# EAGLE design ParallelCNC (EAGLE 6.2)
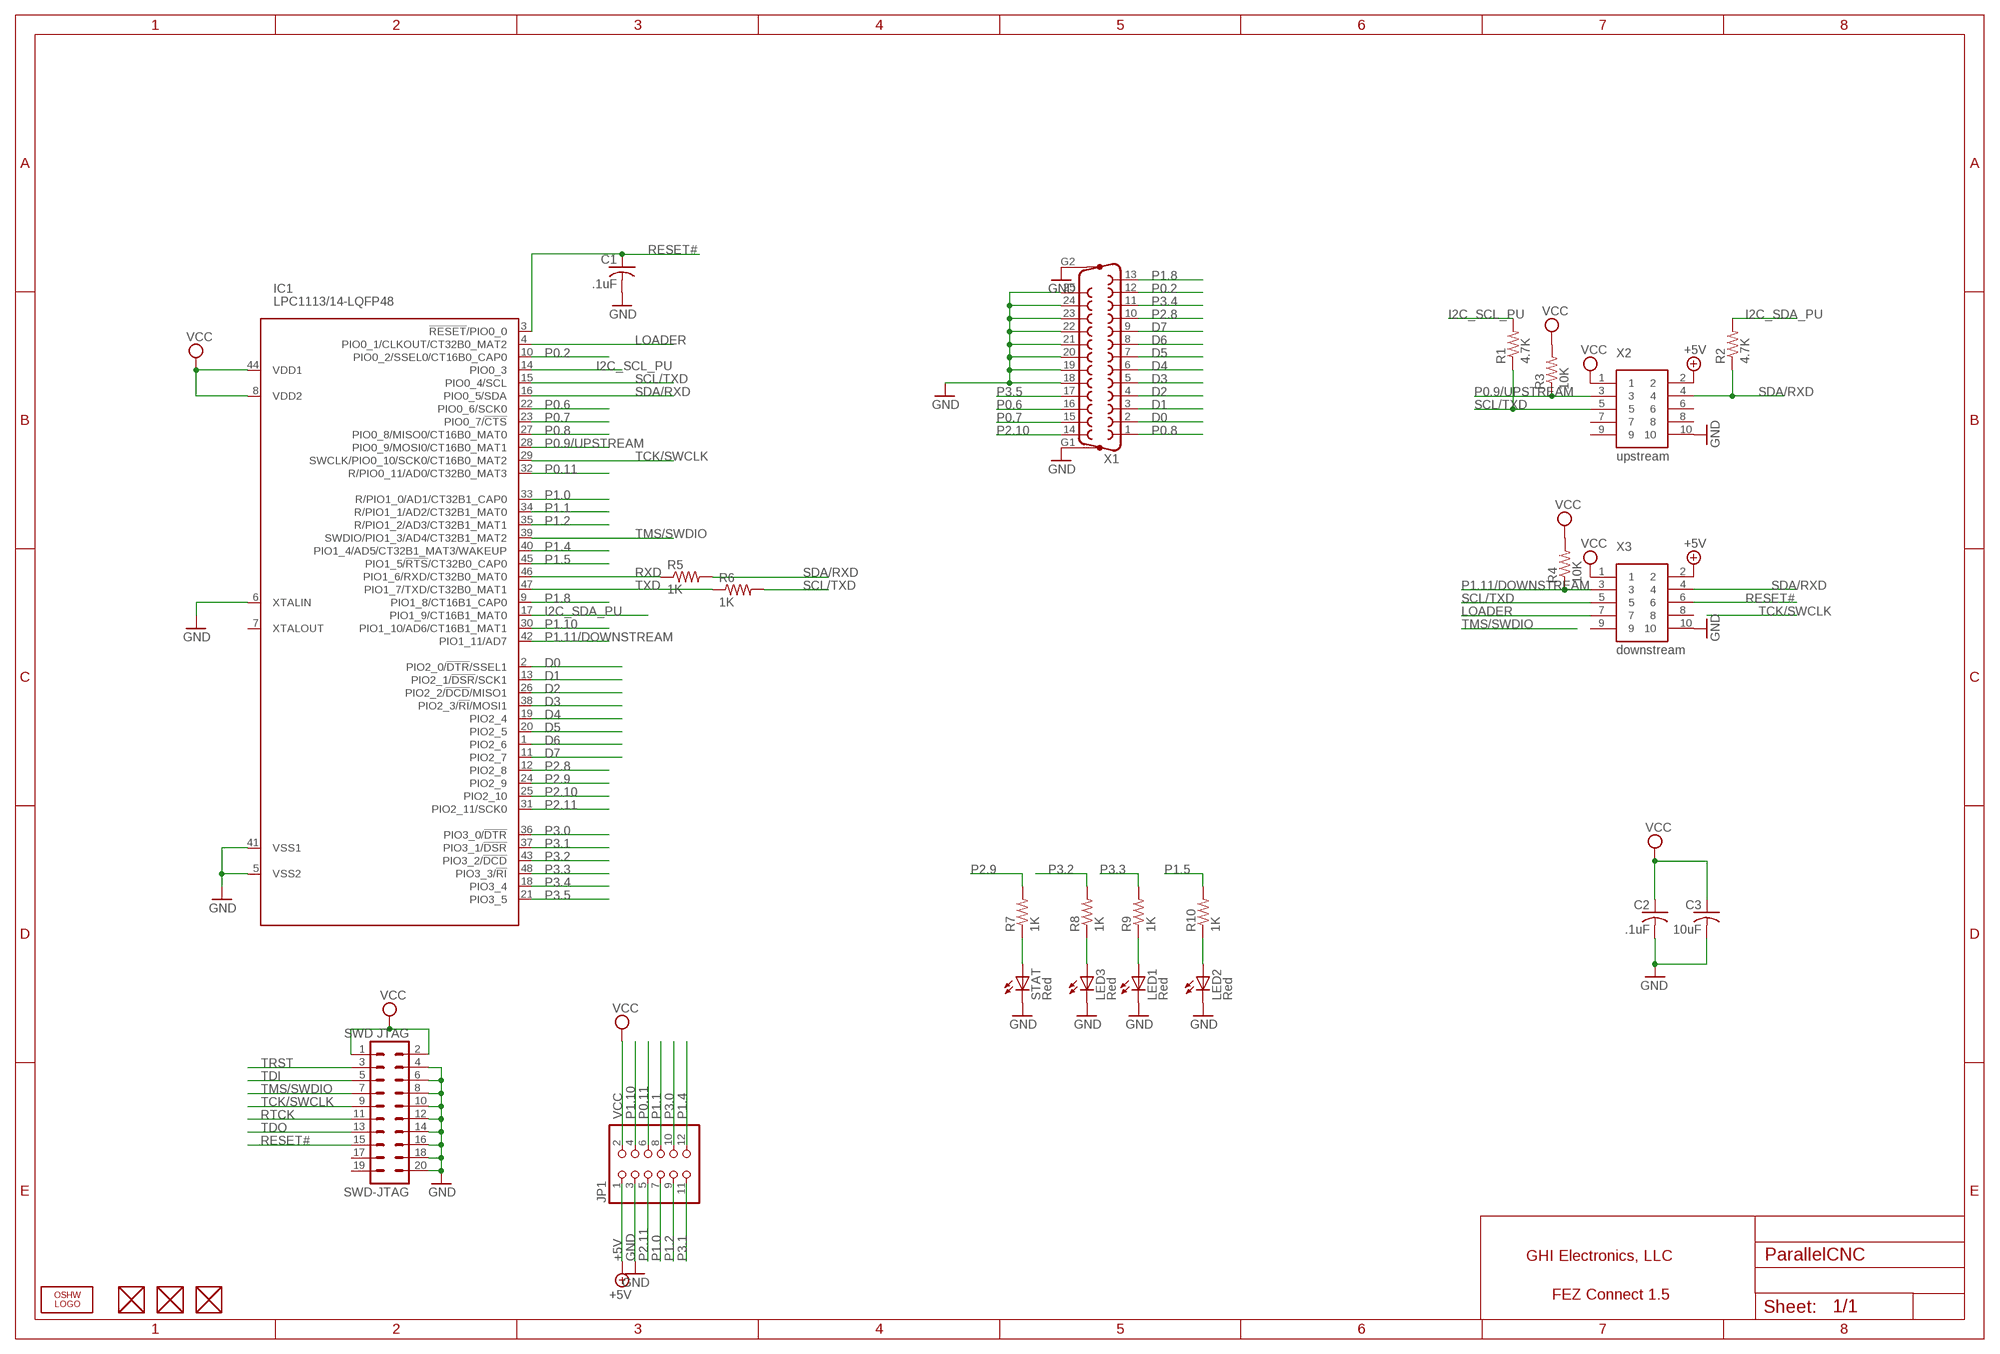
[diagram p0: schematic, sheet 1]

## Parts
C1  .1uF  C-USC0603K  [C0603K]
C2  .1uF  C-USC0603K  [C0603K]
C3  10uF  C-USC0805K  [C0805K]
FUD1  FIDUCIAL  [FIDUCIAL_40MIL]
FUD2  FIDUCIAL  [FIDUCIAL_40MIL]
FUD3  FIDUCIAL  [FIDUCIAL_40MIL]
IC1  LPC1113/14-LQFP48  [LQFP48]
JP1  PINHD-2X6  [2X06]
LED1  Red  LEDCHIPLED_0805  [CHIPLED_0805]
LED2  Red  LEDCHIPLED_0805  [CHIPLED_0805]
LED3  Red  LEDCHIPLED_0805  [CHIPLED_0805]
LOGO1  LOGO-OSHW-FILLX0200-NT  [OSHW_FILLX200_NOTEXT]
R1  4.7K  R-US_R0603  [R0603]
R2  4.7K  R-US_R0603  [R0603]
R3  10K  R-US_R0603  [R0603]
R4  10K  R-US_R0603  [R0603]
R5  1K  R-US_R0603  [R0603]
R6  1K  R-US_R0603  [R0603]
R7  1K  R-US_R0603  [R0603]
R8  1K  R-US_R0603  [R0603]
R9  1K  R-US_R0603  [R0603]
R10  1K  R-US_R0603  [R0603]
STAT  Red  LEDCHIPLED_0805  [CHIPLED_0805]
SWD-JTAG  SWD JTAG  MA10-2  [MA10-2]
X1  F25HP  [F25HP]
X2  upstream  2X5_1.27MM  [2X5_1.27MM]
X3  downstream  2X5_1.27MM  [2X5_1.27MM]

## Nets
+5V: JP1.1 X2.2 X3.2
D0: IC1.2(PIO2_0/!DTR!/SSEL1) X1.2
D1: IC1.13(PIO2_1/!DSR!/SCK1) X1.3
D2: IC1.26(PIO2_2/!DCD!/MISO1) X1.4
D3: IC1.38(PIO2_3/!RI!/MOSI1) X1.5
D4: IC1.19(PIO2_4) X1.6
D5: IC1.20(PIO2_5) X1.7
D6: IC1.1(PIO2_6) X1.8
D7: IC1.11(PIO2_7) X1.9
GND [power]: C1.2 C2.2 C3.2 IC1.5(VSS2) IC1.6(XTALIN) IC1.41(VSS1) JP1.3 LED1.C LED2.C LED3.C STAT.C SWD-JTAG.4 SWD-JTAG.6 SWD-JTAG.8 SWD-JTAG.10 SWD-JTAG.12 SWD-JTAG.14 SWD-JTAG.16 SWD-JTAG.18 SWD-JTAG.20 X1.18 X1.19 X1.20 X1.21 X1.22 X1.23 X1.24 X1.25 X1.G1 X1.G2 X2.10 X3.10
I2C_SCL_PU: IC1.14(PIO0_3) R1.2
I2C_SDA_PU: IC1.17(PIO1_9/CT16B1_MAT0) R2.2
LOADER: IC1.4(PIO0_1/CLKOUT/CT32B0_MAT2) X3.7
N$3: LED3.A R8.1
N$4: LED1.A R9.1
N$5: LED2.A R10.1
N$10: R7.1 STAT.A
P0.2: IC1.10(PIO0_2/SSEL0/CT16B0_CAP0) X1.12
P0.6: IC1.22(PIO0_6/SCK0) X1.16
P0.7: IC1.23(PIO0_7/!CTS!) X1.15
P0.8: IC1.27(PIO0_8/MISO0/CT16B0_MAT0) X1.1
P0.9/UPSTREAM: IC1.28(PIO0_9/MOSI0/CT16B0_MAT1) R3.1 X2.3
P0.11: IC1.32(R/PIO0_11/AD0/CT32B0_MAT3) JP1.6
P1.0: IC1.33(R/PIO1_0/AD1/CT32B1_CAP0) JP1.7
P1.1: IC1.34(R/PIO1_1/AD2/CT32B1_MAT0) JP1.8
P1.2: IC1.35(R/PIO1_2/AD3/CT32B1_MAT1) JP1.9
P1.4: IC1.40(PIO1_4/AD5/CT32B1_MAT3/WAKEUP) JP1.12
P1.5: IC1.45(PIO1_5/!RTS!/CT32B0_CAP0) R10.2
P1.8: IC1.9(PIO1_8/CT16B1_CAP0) X1.13
P1.10: IC1.30(PIO1_10/AD6/CT16B1_MAT1) JP1.4
P1.11/DOWNSTREAM: IC1.42(PIO1_11/AD7) R4.1 X3.3
P2.8: IC1.12(PIO2_8) X1.10
P2.9: IC1.24(PIO2_9) R7.2
P2.10: IC1.25(PIO2_10) X1.14
P2.11: IC1.31(PIO2_11/SCK0) JP1.5
P3.0: IC1.36(PIO3_0/!DTR!) JP1.10
P3.1: IC1.37(PIO3_1/!DSR!) JP1.11
P3.2: IC1.43(PIO3_2/!DCD!) R8.2
P3.3: IC1.48(PIO3_3/!RI!) R9.2
P3.4: IC1.18(PIO3_4) X1.11
P3.5: IC1.21(PIO3_5) X1.17
RESET#: C1.1 IC1.3(!RESET!/PIO0_0) SWD-JTAG.15 X3.6
RTCK: SWD-JTAG.11
RXD: IC1.46(PIO1_6/RXD/CT32B0_MAT0) R5.1
SCL/TXD: IC1.15(PIO0_4/SCL) R1.1 R6.2 X2.5 X3.5
SDA/RXD: IC1.16(PIO0_5/SDA) R2.1 R5.2 X2.4 X3.4
TCK/SWCLK: IC1.29(SWCLK/PIO0_10/SCK0/CT16B0_MAT2) SWD-JTAG.9
TDI: SWD-JTAG.5
TDO: SWD-JTAG.13
TMS/SWDIO: IC1.39(SWDIO/PIO1_3/AD4/CT32B1_MAT2) SWD-JTAG.7
TRST: SWD-JTAG.3
TXD: IC1.47(PIO1_7/TXD/CT32B0_MAT1) R6.1
VCC [power]: C2.1 C3.1 IC1.8(VDD2) IC1.44(VDD1) JP1.2 R3.2 R4.2 SWD-JTAG.1 SWD-JTAG.2 X2.1 X3.1
Unconnected: FUD1.P$1 FUD2.P$1 FUD3.P$1 IC1.7(XTALOUT) SWD-JTAG.17 SWD-JTAG.19 X2.6 X2.7 X2.8 X2.9 X3.8 X3.9

## Notes on the sheet
- Optional 3.3V
- GHI Electronics, LLC
- FEZ Connect 1.5

## Library data of the parts
C1-C3 = rcl:C-US: CAPACITOR, American symbol
FUD1-FUD3 = GHI:FIDUCIAL
IC1 = lpc1100v1.1:LPC1113/14-LQFP48: NXP Semiconductors LPC11xx microcontrollers <http://ics.nxp.com/products/lpc1000/lpc11xx/> ARM 32-bit Cortex-M0 Microcontroller with MPU CPU clock up to 50MHz Up to 32KByte on-chip Flash ROM with In-System Programming (ISP) and In-Application Programming (IAP) via On-Chip Bootloader Up to 8KByte SRAM Nested Vectored Interrupt Controller Up to 2 SPI controllers UART with full Modem Interface and RS485 Support Fast Mode I2C-Bus 4 Timers with 4 capture channels and 13 output channels Watchdog (WDT) Sytem tick timer 10-bit ADC with 8 channels Power Management Unit (PMU) Brownout detection 12MHz internal RC oscillator Serial Wire Debug/Trace port
JP1 = pinhead:PINHD-2X6: PIN HEADER
LED1-LED3 STAT = led:LED: LED OSRAM: - CHIPLED LG R971, LG N971, LY N971, LG Q971, LY Q971, LO R971, LY R971 LH N974, LH R974 LS Q976, LO Q976, LY Q976 LO Q996 - Hyper CHIPLED LW Q18S LB Q993, LB Q99A, LB R99A - SideLED LS A670, LO A670, LY A670, LG A670, LP A670 LB A673, LV A673, LT A673, LW A673 LH A674 LY A675 LS A676, LA A676, LO A676, LY A676, LW A676 LS A679, LY A679, LG A679 - Hyper Micro SIDELED® LS Y876, LA Y876, LO Y876, LY Y876 LT Y87S - SmartLED LW L88C, LW L88S LB L89C, LB L89S, LG L890 LS L89K, LO L89K, LY L89K LS L896, LA L896, LO L896, LY L896 - TOPLED LS T670, LO T670, LY T670, LG T670, LP T670 LSG T670, LSP T670, LSY T670, LOP T670, LYG T670 LG T671, LOG T671, LSG T671 LB T673, LV T673, LT T673, LW T673 LH T674 LS T676, LA T676, LO T676, LY T676, LB T676, LH T676, LSB T676, LW T676 LB T67C, LV T67C, LT T67C, LS T67K, LO T67K, LY T67K, LW E67C LS E67B, LA E67B, LO E67B, LY E67B, LB E67C, LV E67C, LT E67C LW T67C LS T679, LY T679, LG T679 LS T770, LO T770, LY T770, LG T770, LP T770 LB T773, LV T773, LT T773, LW T773 LH T774 LS E675, LA E675, LY E675, LS T675 LS T776, LA T776, LO T776, LY T776, LB T776 LHGB T686 LT T68C, LB T68C - Hyper Mini TOPLED® LB M676 - Mini TOPLED Santana® LG M470 LS M47K, LO M47K, LY M47K Source: http://www.osram.convergy.de LUXEON: - LUMILED® LXK2-PW12-R00, LXK2-PW12-S00, LXK2-PW14-U00, LXK2-PW14-V00 LXK2-PM12-R00, LXK2-PM12-S00, LXK2-PM14-U00 LXK2-PE12-Q00, LXK2-PE12-R00, LXK2-PE12-S00, LXK2-PE14-T00, LXK2-PE14-U00 LXK2-PB12-K00, LXK2-PB12-L00, LXK2-PB12-M00, LXK2-PB14-N00, LXK2-PB14-P00, LXK2-PB14-Q00 LXK2-PR12-L00, LXK2-PR12-M00, LXK2-PR14-Q00, LXK2-PR14-R00 LXK2-PD12-Q00, LXK2-PD12-R00, LXK2-PD12-S00 LXK2-PH12-R00, LXK2-PH12-S00 LXK2-PL12-P00, LXK2-PL12-Q00, LXK2-PL12-R00 Source: www.luxeon.com KINGBRIGHT: KA-3528ASYC Source: www.kingbright.com
LOGO1 = Logo:LOGO-OSHW-FILL
R1-R10 = rcl:R-US_: RESISTOR, American symbol
SWD-JTAG = con-lstb:MA10-2: PIN HEADER
X1 = con-subd:F25HP: SUB-D; OC_FARNELL: unknown; OC_NEWARK: unknown
X2 X3 = GHI:2X5_1.27MM

## Board
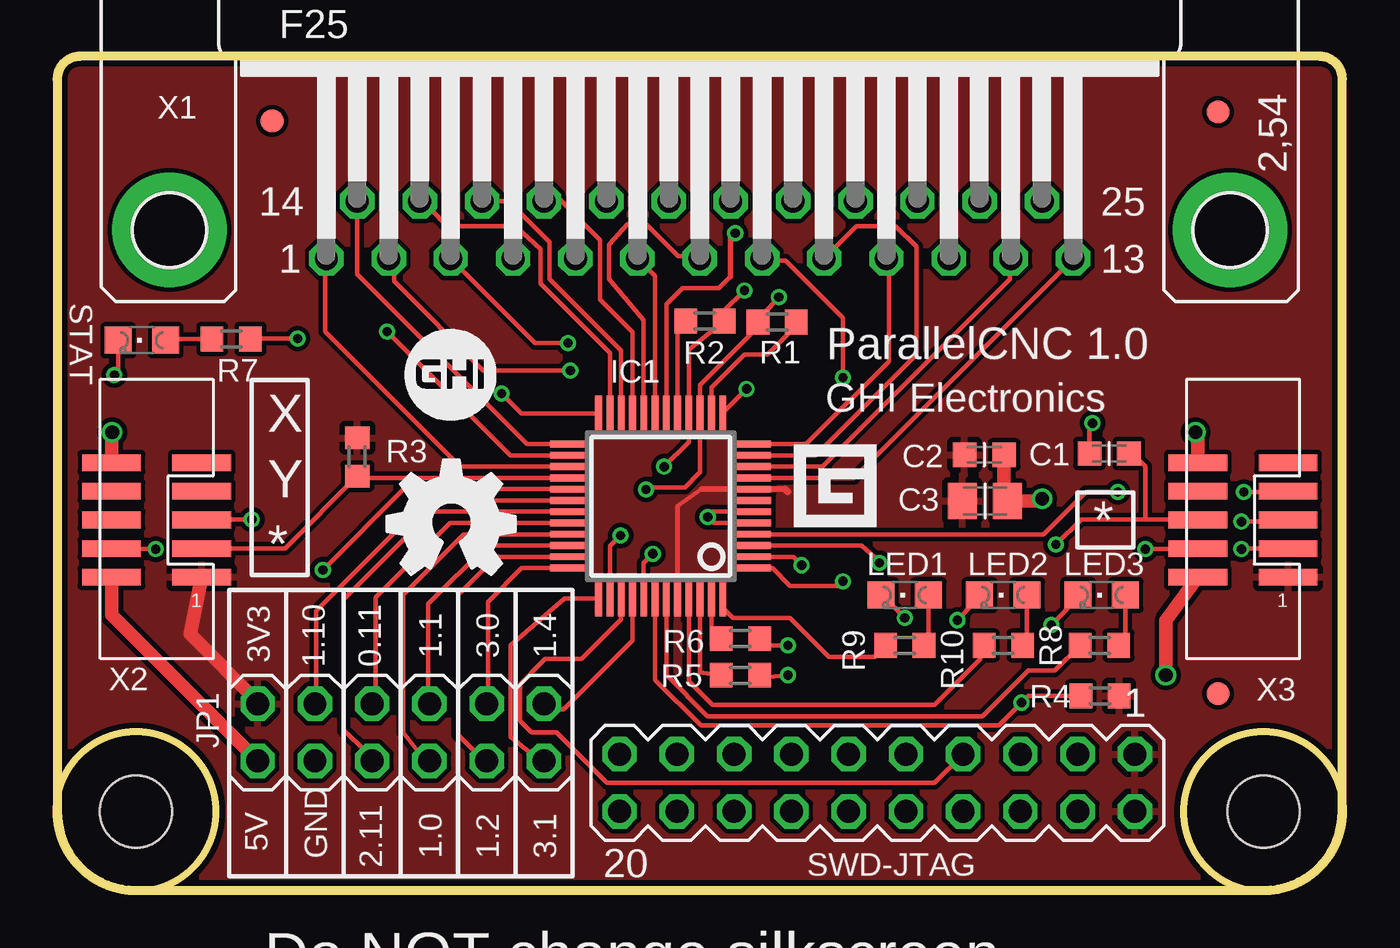
[diagram p1: board, top side]
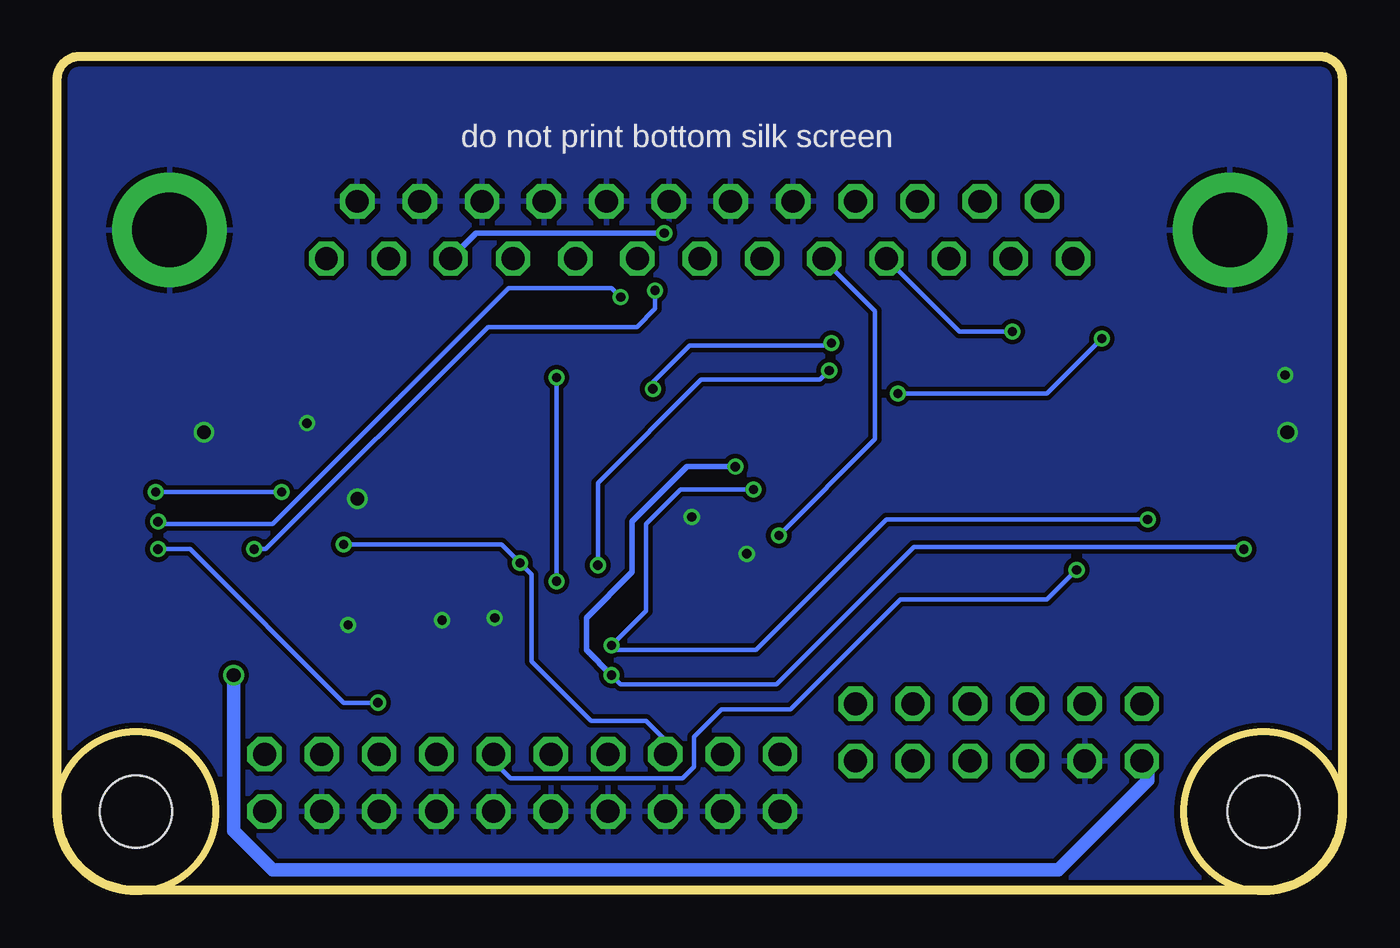
[diagram p2: board, bottom side, seen from below]

Size 57.07 x 37.04 mm. Coordinates in mm from the lower left corner, seen from the top.
Outline: 53.54,0.04 arc90 57.04,3.54 57.04,36.04 arc90 56.04,37.04 1.04,37.04 arc90 0.04,36.04 0.04,3.54 arc90 3.54,0.04 53.54,0.04
Outline: circle at 53.54,3.54 radius 3.54
Outline: circle at 3.54,3.54 radius 3.54
Copper layers (1*16): Top 0.035mm / dielectric 1.5mm / Bottom 0.035mm
Design rules: minimum track width 0.0025mm, minimum drill 10mil, track to track 8mil, track to pad 8mil, pad to pad 7.5mil, via to via 8mil, smd to smd 7.5mil, copper to edge 10mil, drill to drill 10mil, minimum pad ring 10mil, minimum via ring 6mil, stop-mask expansion 2mil, vias tented up to drill 100mil, thermal gap 10mil
Holes 3.2 mm at 3.54,3.54 53.54,3.54

### Footprints (pad centres in the part's own frame; a part is rotated, then mirrored left to right if it is on the bottom)
C0603K = smd 1.05 x 1.08: 1 -0.875,0; 2 0.875,0
C0805K = smd 1.3 x 1.6: 1 -1,0; 2 1,0
FIDUCIAL_40MIL = smd 1.016 x 1.016: P$1 0,0
LQFP48 = smd 0.3 x 1.6: 1 -2.75,-4.1; 2 -2.25,-4.1; 3 -1.75,-4.1; 4 -1.25,-4.1; 5 -0.75,-4.1; 6 -0.25,-4.1; 7 0.25,-4.1; 8 0.75,-4.1; 9 1.25,-4.1; 10 1.75,-4.1; 11 2.25,-4.1; 12 2.75,-4.1; 25 2.75,4.1; 26 2.25,4.1; 27 1.75,4.1; 28 1.25,4.1; 29 0.75,4.1; 30 0.25,4.1; 31 -0.25,4.1; 32 -0.75,4.1; 33 -1.25,4.1; 34 -1.75,4.1; 35 -2.25,4.1; 36 -2.75,4.1 | smd 1.6 x 0.3: 13 4.1,-2.75; 14 4.1,-2.25; 15 4.1,-1.75; 16 4.1,-1.25; 17 4.1,-0.75; 18 4.1,-0.25; 19 4.1,0.25; 20 4.1,0.75; 21 4.1,1.25; 22 4.1,1.75; 23 4.1,2.25; 24 4.1,2.75; 37 -4.1,2.75; 38 -4.1,2.25; 39 -4.1,1.75; 40 -4.1,1.25; 41 -4.1,0.75; 42 -4.1,0.25; 43 -4.1,-0.25; 44 -4.1,-0.75; 45 -4.1,-1.25; 46 -4.1,-1.75; 47 -4.1,-2.25; 48 -4.1,-2.75
2X06 = drill 1.016 octagon: 1 -6.35,-1.27; 2 -6.35,1.27; 3 -3.81,-1.27; 4 -3.81,1.27; 5 -1.27,-1.27; 6 -1.27,1.27; 7 1.27,-1.27; 8 1.27,1.27; 9 3.81,-1.27; 10 3.81,1.27; 11 6.35,-1.27; 12 6.35,1.27
CHIPLED_0805 = smd 1.2 x 1.2: A 0,-1.05; C 0,1.05
R0603 = smd 1 x 1.1: 1 -0.85,0; 2 0.85,0
MA10-2 = drill 1.016 octagon: 1 -11.43,-1.27; 2 -11.43,1.27; 3 -8.89,-1.27; 4 -8.89,1.27; 5 -6.35,-1.27; 6 -6.35,1.27; 7 -3.81,-1.27; 8 -3.81,1.27; 9 -1.27,-1.27; 10 -1.27,1.27; 11 1.27,-1.27; 12 1.27,1.27; 13 3.81,-1.27; 14 3.81,1.27; 15 6.35,-1.27; 16 6.35,1.27; 17 8.89,-1.27; 18 8.89,1.27; 19 11.43,-1.27; 20 11.43,1.27
F25HP = drill 1.016 octagon: 1 -16.561,-1.27; 2 -13.792,-1.27; 3 -11.049,-1.27; 4 -8.28,-1.27; 5 -5.512,-1.27; 6 -2.769,-1.27; 7 0,-1.27; 8 2.769,-1.27; 9 5.512,-1.27; 10 8.28,-1.27; 11 11.049,-1.27; 12 13.792,-1.27; 13 16.561,-1.27; 14 -15.189,1.27; 15 -12.421,1.27; 16 -9.652,1.27; 17 -6.909,1.27; 18 -4.14,1.27; 19 -1.372,1.27; 20 1.372,1.27; 21 4.14,1.27; 22 6.909,1.27; 23 9.652,1.27; 24 12.421,1.27; 25 15.189,1.27 | drill 3.302 pad 5.08: G1 -23.52,0; G2 23.52,0
2X5_1.27MM = smd 2.6 x 0.74: 1 -2,2.58; 2 2,2.58; 3 -2,1.31; 4 2,1.31; 5 -2,0.04; 6 2,0.04; 7 -2,-1.23; 8 2,-1.23; 9 -2,-2.5; 10 2,-2.5

### Placement (x,y rotation side)
C1  46.7,19.42 180 top
C2  41.16,19.36 0 top
C3  41.18,17.31 0 top
FUD1  51.53,8.77 0 top
FUD2  51.53,34.58 0 top
FUD3  9.57,34.17 0 top
IC1  26.8,17.09 90 top
JP1  15.28,7.05 0 top
LED1  37.63,13.14 90 top
LED2  42,13.14 90 top
LED3  46.37,13.14 90 top
LOGO1  14.68,14.06 0 top
R1  31.97,25.25 0 top
R2  28.76,25.29 180 top
R3  13.35,19.26 90 top
R4  46.29,8.67 0 top
R5  30.34,9.58 0 top
R6  30.34,11.21 0 top
R7  7.76,24.5 0 top
R8  46.26,10.91 180 top
R9  37.63,10.91 180 top
R10  42,10.91 180 top
STAT  3.79,24.44 90 top
SWD-JTAG  36.41,4.81 180 top
X1  28.54,29.33 0 top
X2  4.45,16.51 180 top
X3  52.63,16.51 180 top

### Tracks (layer width: path | path; a pad name or v marks a point on that pad's centre or on a via)
+5V  (via drill 0.61)
  Top 0.61: X3.2 49.21,12.01 v49.21,9.59 | X2.2 2.45,12.26 JP1.1
  Bottom 0.61: v49.21,9.59 49.21,2.68 47.48,0.95 12.63,0.95 8.67,4.91 8.67,5.52 JP1.1
D0  (via drill 0.41)
  Top 0.203: IC1.2 32.68,14.84 v33.06,14.46 | v22.79,23.1 18.93,23.1 14.97,27.06 14.97,27.84 X1.2
  Bottom 0.203: v33.06,14.46 33.06,18.12 28.48,22.69 23.2,22.69 v22.79,23.1
D1  (via drill 0.41)
  Top 0.203: IC1.13 29.55,21.22 v30.62,22.29 | v22.69,24.32 21.23,24.32 X1.3
  Bottom 0.203: v30.62,22.29 30.62,22.59 28.99,24.22 22.79,24.22 v22.69,24.32
D2  (via drill 0.41)
  Top 0.203: IC1.26 20.16,19.34 v14.67,24.83
  Bottom 0.203: v14.67,24.83 17.02,24.83 X1.4
D3  (via drill 0.41)
  Top 0.203: IC1.38 24.55,15.31 v25.03,15.78
  Bottom 0.203: X1.5 23.02,28 20.76,25.74 20.76,20.05 v25.03,15.78
D4
  Top 0.203: IC1.19 26.55,27.28 X1.6
D5
  Top 0.203: IC1.20 26.05,25.33 24.52,27.16 24.52,28.69 25.33,29.6 26.15,29.6 27.57,28.18 28.42,28.18 X1.7
D6  (via drill 0.41)
  Top 0.203: IC1.1 31.76,14.34 32.55,13.55 34.68,13.55 v34.88,13.75 | v34.88,22.79 34.88,25.44 32.34,27.98 31.39,27.98 X1.8
  Bottom 0.203: v34.88,13.75 v34.88,22.79
D7
  Top 0.203: IC1.11 33.66,19.34 38.14,23.81 38.14,28.59 37.22,29.5 35.48,29.5 X1.9
GND  (via drill 0.41, 0.61)
  Top 0.203: IC1.41 26.05,14.57 v26.45,14.97 | IC1.6 29.13,16.84 v28.89,16.6 29.15,16.34 IC1.5 | STAT.C 2.74,23.06 v2.58,22.9 | LED1.C 36.61,13.14 v37.63,12.13 | LED2.C 40.95,13.07 v39.96,12.02 | LED3.C 45.32,13.01 v44.13,11.82 | C1.2 45.82,20.62 v45.96,20.76
  Top 0.61: X3.10 50.63,20.26 v50.53,20.36 | X2.10 2.45,20.33 v2.47,20.36 | v43.72,17.41 43.62,17.31 C3.2 42.03,17.46 C2.2
  pour Bottom: -0.17,37.04 56.95,37.04 56.95,0.04 -0.17,0.04
I2C_SCL_PU
  Top 0.203: IC1.14 29.05,22.35 30.52,23.81 31.53,23.81 32.45,24.72 32.45,25.22 R1.2
I2C_SDA_PU
  Top 0.203: IC1.17 27.55,25.23 R2.2
LOADER  (via drill 0.41)
  Top 0.203: v52.66,17.71 54.6,17.71 X3.7 | IC1.4 43.78,15.84 45.65,17.71 v47.08,17.71
  Bottom 0.203: v47.08,17.71 v52.66,17.71
N$3
  Top 0.203: LED3.A 47.42,11.21 R8.1
N$4
  Top 0.203: LED1.A 38.68,11.11 R9.1
N$5
  Top 0.203: LED2.A 43.05,11.11 R10.1
N$10
  Top 0.203: R7.1 4.9,24.5 STAT.A
P0.2
  Top 0.203: IC1.10 33.97,18.84 42.3,27.16 42.3,28.04 X1.12
P0.6
  Top 0.203: IC1.22 25.05,23.99 21.88,27.16 21.88,28.79 20.05,30.62 18.73,30.62
  Top 0.254: 18.73,30.62 18.87,30.62 X1.16
P0.7
  Top 0.203: IC1.23 24.55,23.88 21.47,26.96 21.47,28.48 20.36,29.5 17.31,29.5 16.19,30.72
  Top 0.254: 16.19,30.72 16.19,30.68 X1.15
P0.8
  Top 0.203: IC1.27 17.91,18.84 11.92,24.83 11.92,27.98 12.23,28.28
  Top 0.254: 11.92,27.98 11.92,28.01 X1.1
P0.9/UPSTREAM
  Top 0.203: IC1.28 13.43,18.34 R3.1 10.14,15.2 X2.3
P0.11
  Top 0.203: IC1.32 17.45,16.34 14.16,13.04 14.16,8.57
  Top 0.254: 14.16,8.57 14.16,8.47 JP1.6
P1.0
  Top 0.203: IC1.33 18.07,15.84 15.38,13.14 15.38,7.05 16.49,5.62
  Top 0.254: 16.49,5.62 16.49,5.73 JP1.7
P1.1
  Top 0.203: IC1.34 19.1,15.34 16.49,12.74 16.49,8.37 | JP1.8 16.6,8.27
  Top 0.254: 16.49,8.37 JP1.8
P1.2
  Top 0.203: IC1.35 19.51,14.84 17.82,13.14 17.82,6.94 19.03,5.73
  Top 0.254: 19.03,5.73 JP1.9
P1.4
  Top 0.203: IC1.40 25.55,11.12 22.49,8.06 21.88,8.06
  Top 0.254: 21.88,8.06 JP1.12
P1.5
  Top 0.203: IC1.45 28.05,9.31 29.09,8.27 38.95,8.27 40.98,10.3 40.98,10.74 R10.2
P1.8
  Top 0.203: IC1.9 35.37,18.34 X1.13
P1.10
  Top 0.203: IC1.30 16.42,17.34 11.52,12.43 11.52,8.37 11.72,8.16
  Top 0.254: 11.52,8.37 JP1.4
P1.11/DOWNSTREAM  (via drill 0.41)
  Top 0.203: X3.3 52.59,15.2 v52.56,15.17 | IC1.42 26.55,9.38 28.59,7.35 41.79,7.35 v42.81,8.37 43.11,8.67 R4.1
  Bottom 0.203: v52.56,15.17 51.13,15.17 44.33,8.37 v42.81,8.37
P2.8
  Top 0.203: IC1.12 33.25,19.84 36.92,23.51 36.92,27.77 36.81,27.87
  Top 0.254: 36.81,27.87 X1.10
P2.9  (via drill 0.41)
  Top 0.203: IC1.24 20.64,21.19 v19.75,22.08 | v10.7,24.52 8.63,24.52 R7.2
  Bottom 0.203: v19.75,22.08 13.14,22.08 v10.7,24.52
P2.10
  Top 0.203: IC1.25 20.87,19.84 13.35,27.37 13.35,30.62 13.45,30.72
  Top 0.254: 13.35,30.62 X1.14
P2.11
  Top 0.203: IC1.31 16.63,16.84 12.74,12.94 12.74,7.15 14.36,5.62
  Top 0.254: 14.36,5.62 14.16,5.62 JP1.5
P3.0
  Top 0.203: IC1.36 20.64,14.34 19.14,12.84 19.14,8.37
  Top 0.254: 19.14,8.37 JP1.10
P3.1
  Top 0.203: IC1.37 22.54,12.99 20.15,10.91 20.15,6.84 21.78,5.52
  Top 0.254: 21.78,5.52 21.78,5.62 JP1.11
P3.2
  Top 0.203: IC1.43 27.05,9.59 28.89,7.76 41.08,7.76 43.11,9.79 44.3,9.79 R8.2
P3.3
  Top 0.203: IC1.48 29.55,12.58 30.01,12.13 32.55,12.13 34.27,10.4 36.31,10.4 36.31,10.44 R9.2
P3.4  (via drill 0.41)
  Top 0.203: IC1.18 27.05,26.04 27.77,26.76 29.4,26.76 29.91,27.26
  Top 0.254: 29.91,27.26 29.91,28.99 v30.11,29.19
  Bottom 0.254: v30.11,29.19 38.45,29.19 X1.11
P3.5
  Top 0.203: IC1.21 25.55,24.81 24.11,26.25 24.11,28.89 22.29,30.72 21.47,30.72 21.27,30.52
  Top 0.254: 21.47,30.72 21.51,30.72 X1.17
RESET#  (via drill 0.41)
  Top 0.203: IC1.3 35.7,15.34 36.51,14.63 v36.51,14.56 | X3.6 50.6,16.49 48.3,16.49 | 48.3,16.49 45.45,16.49 v44.33,15.38 | C1.1 47.71,19.42 48.3,18.83 48.3,16.49
  Bottom 0.203: SWD-JTAG.15 30.06,6.69 30.92,7.55 33.36,7.55 36,10.2 36,14.06 v36.51,14.56 37.32,15.38 v44.33,15.38
RXD
  Top 0.203: IC1.46 28.55,9.7 R5.1
SCL/TXD  (via drill 0.41)
  Top 0.203: v32.04,26.35 31.12,25.33 R1.1 31.02,24.95 30.62,24.52 28.55,22.46 IC1.15 28.55,18.6 27.87,17.92 26.25,17.92 v26.15,17.82 | v52.56,16.39 54.55,16.39 X3.5 | v8.67,16.49 6.47,16.49 X2.5 | v32.45,10.91 31.39,10.91 R6.2
  Bottom 0.203: 31.94,26.25 v32.04,26.35 32.45,26.76 37.02,26.76 47.48,16.29 52.36,16.29 v52.56,16.39 | v8.67,16.49 20.25,16.49 26.05,10.7 32.24,10.7 v32.45,10.91 30.92,12.43 30.92,16.29 29.4,17.82 v26.15,17.82
SDA/RXD  (via drill 0.41)
  Top 0.203: v30.52,26.65 29.61,25.75 R2.1 28.05,24.03 IC1.16 28.05,19.92 v26.96,18.83 | v48.3,15.17 50.6,15.17 X3.4 | v4.4,15.17 2.47,15.17 X2.4 | v32.45,9.59 31.29,9.48 R5.2
  Bottom 0.203: v30.52,26.65 30.52,25.84 31.33,25.03 37.93,25.03 47.79,15.17 v48.3,15.17 | v4.4,15.17 4.51,15.28 19.03,15.28 25.13,9.18 32.04,9.18 v32.45,9.59
  Bottom 0.254: v26.96,18.83 29.09,18.83 31.53,16.39 31.53,14.16 33.56,12.13 33.56,10.7 v32.45,9.59
TCK/SWCLK  (via drill 0.41)
  Top 0.203: IC1.29 15.4,17.84 v11.82,14.26
  Bottom 0.203: SWD-JTAG.9 37.68,5.78 36.92,5.01 29.3,5.01 28.79,5.52 28.79,6.84 27.57,8.06 24.52,8.06 19.64,12.94 13.14,12.94 v11.82,14.26
TMS/SWDIO
  Top 0.203: IC1.39 25.05,12.05 23.3,10.3 21.68,10.3 20.56,9.18 20.56,7.55 21.07,7.05 22.18,7.05 24.42,4.81 38.95,4.81 SWD-JTAG.7
TXD
  Top 0.203: IC1.47 29.05,10.93 R6.1
VCC
  Top 0.203: IC1.44 27.55,17.09 28.61,17.84
  Top 0.254: 32.32,17.84 IC1.8 28.61,17.84
  Top 0.305: 32.32,17.84 32.45,17.71
  Top 0.61: X2.1 5.94,11.41 8.98,8.37
  pour Top: 0.14,37.32 0.14,0.14 57.13,0.14 57.13,37.32

### Text on the board
tPlace: ParallelCNC 1.0 | GHI Electronics | X | Y | * | * | 3V3 | 1.10 | 0.11 | 1.1 | 3.0 | 1.4 | 5V | GND | 2.11 | 1.0 | 1.2 | 3.1 | Do NOT change silkscreen | Do NOT remove circles | Silk screen is only removed on exposed copper
bPlace: do not print bottom silk screen